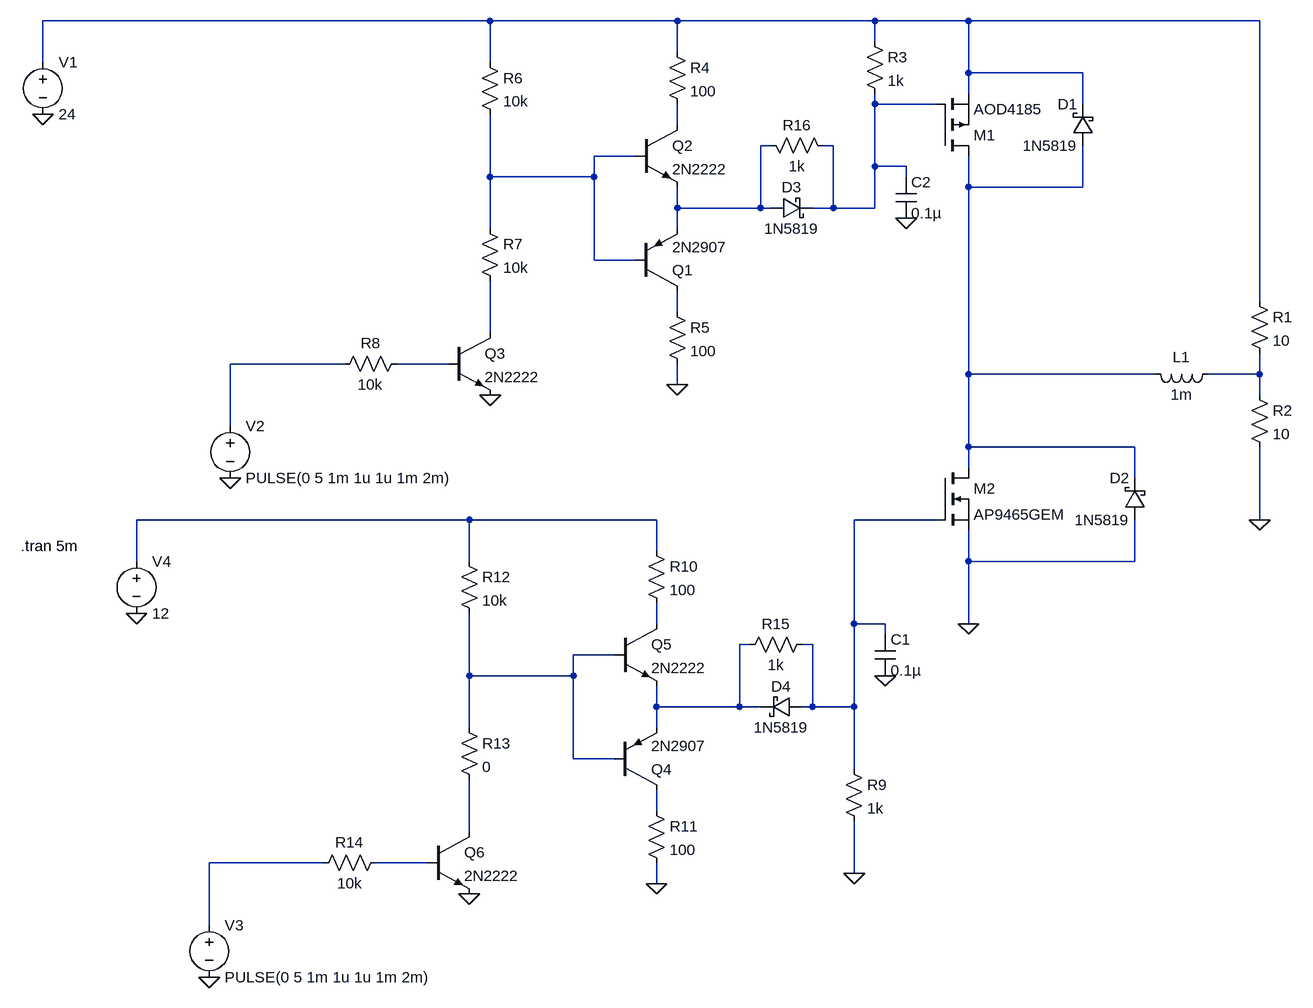
[diagram p0: schematic Motor_Driver_Complimentary.asc]
Motor_Driver_Complimentary.asc, the LTspice schematic file:
Version 4
SHEET 1 888 1252
WIRE -352 -240 -1040 -240
WIRE -64 -240 -352 -240
WIRE 240 -240 -64 -240
WIRE 384 -240 240 -240
WIRE 832 -240 384 -240
WIRE 240 -208 240 -240
WIRE -64 -192 -64 -240
WIRE -1040 -176 -1040 -240
WIRE -352 -176 -352 -240
WIRE 384 -160 384 -240
WIRE 560 -160 384 -160
WIRE 384 -128 384 -160
WIRE 240 -112 240 -128
WIRE 336 -112 240 -112
WIRE 560 -112 560 -160
WIRE -64 -80 -64 -112
WIRE 80 -48 64 -48
WIRE 176 -48 160 -48
WIRE -128 -32 -192 -32
WIRE 240 -16 240 -112
WIRE 288 -16 240 -16
WIRE -352 0 -352 -96
WIRE -192 0 -192 -32
WIRE -192 0 -352 0
WIRE 288 0 288 -16
WIRE 384 16 384 -32
WIRE 560 16 560 -48
WIRE 560 16 384 16
WIRE -64 48 -64 16
WIRE 64 48 64 -48
WIRE 64 48 -64 48
WIRE 80 48 64 48
WIRE 176 48 176 -48
WIRE 176 48 144 48
WIRE 240 48 240 -16
WIRE 240 48 176 48
WIRE -352 80 -352 0
WIRE -64 80 -64 48
WIRE -192 128 -192 0
WIRE -128 128 -192 128
WIRE 832 192 832 -240
WIRE -64 208 -64 176
WIRE -352 240 -352 160
WIRE -576 288 -752 288
WIRE -416 288 -496 288
WIRE 384 304 384 16
WIRE 672 304 384 304
WIRE 832 304 832 272
WIRE 832 304 752 304
WIRE -64 320 -64 288
WIRE 832 336 832 304
WIRE -752 384 -752 288
WIRE 384 416 384 304
WIRE 640 416 384 416
WIRE 384 448 384 416
WIRE 640 464 640 416
WIRE -384 528 -896 528
WIRE -96 528 -384 528
WIRE 336 528 208 528
WIRE 832 528 832 416
WIRE -96 576 -96 528
WIRE -896 592 -896 528
WIRE -384 592 -384 528
WIRE 384 592 384 544
WIRE 640 592 640 528
WIRE 640 592 384 592
WIRE -96 688 -96 656
WIRE 208 688 208 528
WIRE 256 688 208 688
WIRE 384 688 384 592
WIRE 256 704 256 688
WIRE 48 720 32 720
WIRE 144 720 128 720
WIRE -160 736 -224 736
WIRE -384 768 -384 672
WIRE -224 768 -224 736
WIRE -224 768 -384 768
WIRE -96 816 -96 784
WIRE 32 816 32 720
WIRE 32 816 -96 816
WIRE 64 816 32 816
WIRE 144 816 144 720
WIRE 144 816 128 816
WIRE 208 816 208 688
WIRE 208 816 144 816
WIRE -384 848 -384 768
WIRE -96 848 -96 816
WIRE -224 896 -224 768
WIRE -160 896 -224 896
WIRE 208 912 208 816
WIRE -96 976 -96 944
WIRE -384 1008 -384 928
WIRE -608 1056 -784 1056
WIRE -448 1056 -528 1056
WIRE 208 1072 208 992
WIRE -96 1088 -96 1056
WIRE -784 1152 -784 1056
FLAG 832 528 0
FLAG -64 320 0
FLAG -352 336 0
FLAG -1040 -96 0
FLAG -752 464 0
FLAG 384 688 0
FLAG -96 1088 0
FLAG -384 1104 0
FLAG -784 1232 0
FLAG 208 1072 0
FLAG -896 672 0
FLAG 256 768 0
FLAG 288 64 0
SYMBOL pnp -128 176 M180
SYMATTR InstName Q1
SYMATTR Value 2N2907
SYMBOL npn -128 -80 R0
SYMATTR InstName Q2
SYMATTR Value 2N2222
SYMBOL pmos 336 -32 M180
SYMATTR InstName M1
SYMATTR Value AOD4185
SYMBOL nmos 336 448 R0
SYMATTR InstName M2
SYMATTR Value AP9465GEM
SYMBOL res 816 176 R0
SYMATTR InstName R1
SYMATTR Value 10
SYMBOL res 816 320 R0
SYMATTR InstName R2
SYMATTR Value 10
SYMBOL ind 768 288 R90
WINDOW 0 5 56 VBottom 2
WINDOW 3 32 56 VTop 2
SYMATTR InstName L1
SYMATTR Value 1m
SYMBOL voltage -1040 -192 R0
SYMATTR InstName V1
SYMATTR Value 24
SYMBOL res 224 -224 R0
SYMATTR InstName R3
SYMATTR Value 1k
SYMBOL res -80 -208 R0
SYMATTR InstName R4
SYMATTR Value 100
SYMBOL res -80 192 R0
SYMATTR InstName R5
SYMATTR Value 100
SYMBOL npn -416 240 R0
SYMATTR InstName Q3
SYMATTR Value 2N2222
SYMBOL res -368 -192 R0
SYMATTR InstName R6
SYMATTR Value 10k
SYMBOL res -368 64 R0
SYMATTR InstName R7
SYMATTR Value 10k
SYMBOL res -480 272 R90
WINDOW 0 0 56 VBottom 2
WINDOW 3 32 56 VTop 2
SYMATTR InstName R8
SYMATTR Value 10k
SYMBOL voltage -752 368 R0
WINDOW 123 0 0 Left 0
WINDOW 39 0 0 Left 0
SYMATTR InstName V2
SYMATTR Value PULSE(0 5 1m 1u 1u 1m 2m)
SYMBOL pnp -160 944 M180
SYMATTR InstName Q4
SYMATTR Value 2N2907
SYMBOL npn -160 688 R0
SYMATTR InstName Q5
SYMATTR Value 2N2222
SYMBOL res -112 560 R0
SYMATTR InstName R10
SYMATTR Value 100
SYMBOL res -112 960 R0
SYMATTR InstName R11
SYMATTR Value 100
SYMBOL npn -448 1008 R0
SYMATTR InstName Q6
SYMATTR Value 2N2222
SYMBOL res -400 576 R0
SYMATTR InstName R12
SYMATTR Value 10k
SYMBOL res -400 832 R0
SYMATTR InstName R13
SYMATTR Value 0
SYMBOL res -512 1040 R90
WINDOW 0 0 56 VBottom 2
WINDOW 3 32 56 VTop 2
SYMATTR InstName R14
SYMATTR Value 10k
SYMBOL voltage -784 1136 R0
WINDOW 123 0 0 Left 0
WINDOW 39 0 0 Left 0
SYMATTR InstName V3
SYMATTR Value PULSE(0 5 1m 1u 1u 1m 2m)
SYMBOL res 192 896 R0
SYMATTR InstName R9
SYMATTR Value 1k
SYMBOL voltage -896 576 R0
SYMATTR InstName V4
SYMATTR Value 12
SYMBOL schottky 576 -48 R180
WINDOW 0 24 64 Left 2
WINDOW 3 24 0 Left 2
SYMATTR InstName D1
SYMATTR Value 1N5819
SYMATTR Description Diode
SYMATTR Type diode
SYMBOL schottky 656 528 R180
WINDOW 0 24 64 Left 2
WINDOW 3 24 0 Left 2
SYMATTR InstName D2
SYMATTR Value 1N5819
SYMATTR Description Diode
SYMATTR Type diode
SYMBOL schottky 128 800 R90
WINDOW 0 0 32 VBottom 2
WINDOW 3 32 32 VTop 2
SYMATTR InstName D4
SYMATTR Value 1N5819
SYMATTR Description Diode
SYMATTR Type diode
SYMBOL res 144 704 R90
WINDOW 0 0 56 VBottom 2
WINDOW 3 32 56 VTop 2
SYMATTR InstName R15
SYMATTR Value 1k
SYMBOL cap 240 704 R0
SYMATTR InstName C1
SYMATTR Value 0.1µ
SYMBOL schottky 80 32 M90
WINDOW 0 0 32 VBottom 2
WINDOW 3 32 32 VTop 2
SYMATTR InstName D3
SYMATTR Value 1N5819
SYMATTR Description Diode
SYMATTR Type diode
SYMBOL res 64 -64 M90
WINDOW 0 0 56 VBottom 2
WINDOW 3 32 56 VTop 2
SYMATTR InstName R16
SYMATTR Value 1k
SYMBOL cap 272 0 R0
SYMATTR InstName C2
SYMATTR Value 0.1µ
TEXT -1074 568 Left 2 !.tran 5m

The netlist it stands for:
* Motor_Driver_Complimentary.asc
Q1 N007 N005 N004 0 2N2907
Q2 N003 N005 N004 0 2N2222
M1 N006 N002 N001 N001 AOD4185
M2 N006 N013 0 0 AP9465GEM
R1 N001 N011 10
R2 N011 0 10
L1 N011 N006 1m
V1 N001 0 24
R3 N001 N002 1k
R4 N001 N003 100
R5 N007 0 100
Q3 N008 N010 0 0 2N2222
R6 N001 N005 10k
R7 N005 N008 10k
R8 N010 N009 10k
V2 N009 0 PULSE(0 5 1m 1u 1u 1m 2m)
Q4 N017 N016 N015 0 2N2907
Q5 N014 N016 N015 0 2N2222
R10 N012 N014 100
R11 N017 0 100
Q6 N018 N020 0 0 2N2222
R12 N012 N016 10k
R13 N016 N018 0
R14 N020 N019 10k
V3 N019 0 PULSE(0 5 1m 1u 1u 1m 2m)
R9 N013 0 1k
V4 N012 0 12
D1 N006 N001 1N5819
D2 0 N006 1N5819
D4 N013 N015 1N5819
R15 N013 N015 1k
C1 N013 0 0.1µ
D3 N004 N002 1N5819
R16 N004 N002 1k
C2 N002 0 0.1µ
.model D D
.lib standard.dio
.model NPN NPN
.model PNP PNP
.lib standard.bjt
.model NMOS NMOS
.model PMOS PMOS
.lib standard.mos
.tran 5m
.backanno
.end